# Altium schematic sheet IsolatedADC.SCHDOC
size A4; Organization: UNSW Solar Racing Team; Address3: UNSW; Address4: Sydney NSW 2052; Address2: Electrical Engineering; Address1: Rm 109
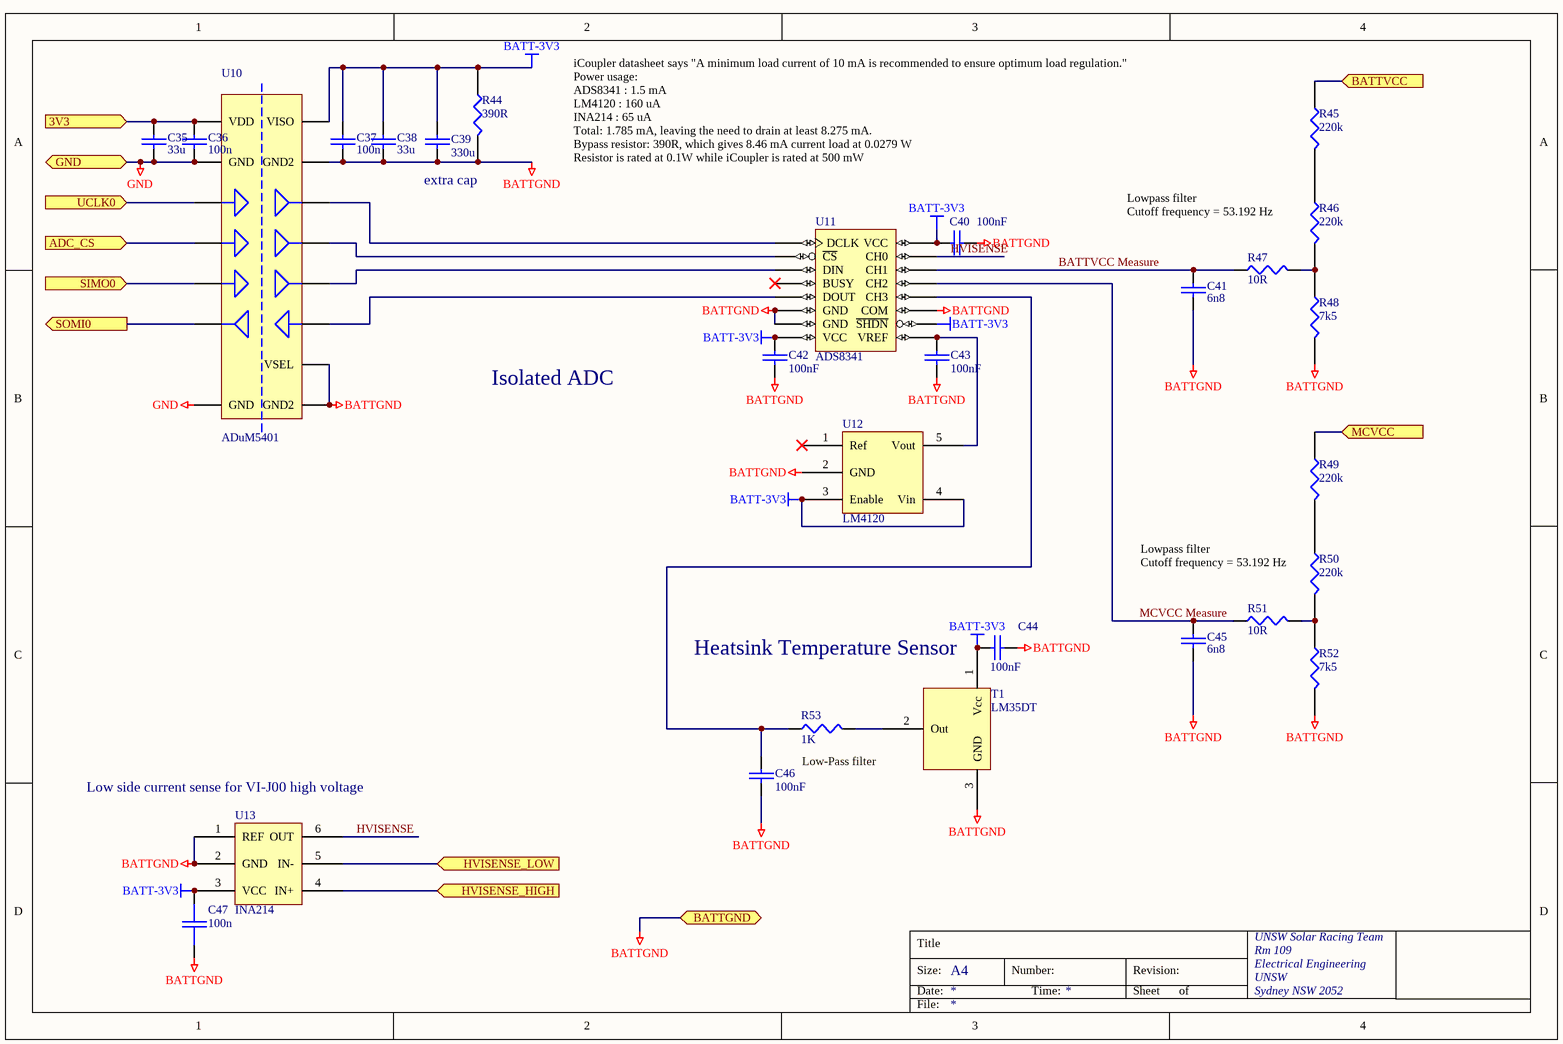
[diagram p0: IsolatedADC.SCHDOC]

## Parts
C35  33u  [MCCT-CASEB]
C36  100n  [0603]
C37  100n  [0603]
C38  33u  [MCCT-CASEB]
C39  330u  [KEMET_CASED]
C40  100nF  [0603]
C41  6n8  [0603]
C42  100nF  [0603]
C43  100nF  [0603]
C44  100nF  [0603]
C45  6n8  [0603]
C46  100nF  [0603]
C47  100n  [0603]
R44  390R  [0603]
R45  220k  [1206]
R46  220k  [1206]
R47  10R  [0603]
R48  7k5  [1206]
R49  220k  [1206]
R50  220k  [1206]
R51  10R  [0603]
R52  7k5  [1206]
R53  1K  [0603]
T1  LM35DT  [TO-220-up]
U10  ADuM5401  [SOIC_W16]
U11  ADS8341  [TSSOP16]
U12  LM4120  [SOT23-5]
U13  INA214  [SC70-6]

## Ports
3V3 (in), ADC_CS (in), BATTGND, BATTVCC (in), GND (bidir), HVISENSE_HIGH (in), HVISENSE_LOW (in), MCVCC (in), SIMO0 (in), SOMI0 (out), UCLK0 (in)

## Nets
BATT-3V3: C37.2 C38.2 C39.1 C40.1 C42.2 C44.1 C47.2 R44.1 T1.1(Vcc) U10.16(VISO) U11.1(VCC) U11.7(~{SHDN}) U11.9(VCC) U12.3(Enable) U12.4(Vin) U13.3(VCC)
BATTGND: C37.1 C38.1 C39.2 C40.2 C41.2 C42.1 C43.2 C44.2 C45.2 C46.2 C47.1 R44.2 R48.2 R52.2 T1.3(GND) U10.9(GND2) U10.10(VSEL) U10.15(GND2) U11.6(COM) U11.10(GND) U11.11(GND) U12.2(GND) U13.1(REF) U13.2(GND) ; port BATTGND
GND: C35.1 C36.1 U10.2(GND) U10.8(GND) ; port GND
3V3: C35.2 C36.2 U10.1(VDD) ; port 3V3
ADC_CS: U10.4(IN2) ; port ADC_CS
BATTVCC: R45.1 ; port BATTVCC
BATTVCC Measure: C41.1 R47.1 U11.3(CH1)
HVISENSE: U11.2(CH0) U13.6(OUT)
HVISENSE_HIGH: U13.4(IN+) ; port HVISENSE_HIGH
HVISENSE_LOW: U13.5(IN-) ; port HVISENSE_LOW
MCVCC: R49.1 ; port MCVCC
MCVCC Measure: C45.1 R51.1 U11.4(CH2)
SIMO0: U10.5(IN3) ; port SIMO0
SOMI0: U10.6(OUT4) ; port SOMI0
UCLK0: U10.3(IN1) ; port UCLK0
NetC43_1: C43.1 U11.8(VREF) U12.5(Vout)
NetC46_1: C46.1 R53.1 U11.5(CH3)
NetR45_2: R45.2 R46.1
NetR46_2: R46.2 R47.2 R48.1
NetR49_2: R49.2 R50.1
NetR50_2: R50.2 R51.2 R52.1
NetR53_2: R53.2 T1.2(Out)
NetU10_11: U10.11(IN4) U11.12(DOUT)
NetU10_12: U10.12(OUT3) U11.14(DIN)
NetU10_13: U10.13(OUT2) U11.15(~{CS})
NetU10_14: U10.14(OUT1) U11.16(DCLK)

Not connected (* = marked no-connect by the designer): U11 13(BUSY)*; U12 1(Ref)*

## Notes on the sheet
- extra cap
- iCoupler datasheet says "A minimum load current of 10 mA is recommended to ensure optimum load regulation."
  Power usage:
  ADS8341 : 1.5 mA
  LM4120 : 160 uA
  INA214 : 65 uA
  Total: 1.785 mA, leaving the need to drain at least 8.275 mA.
  Bypass resistor: 390R, which gives 8.46 mA current load at 0.0279 W
  Resistor is rated at 0.1W while iCoupler is rated at 500 mW
- (near R46) Lowpass filter
  Cutoff frequency = 53.192 Hz
- Isolated ADC
- (near R50) Lowpass filter
  Cutoff frequency = 53.192 Hz
- (near C44) Heatsink Temperature Sensor
- (near U13) Low side current sense for VI-J00 high voltage
- Low-Pass filter
- Title
- Size:
- Date:
- A4
- Number:
- Time:
- Revision:
- Sheet
- of
- File:

## Library data of the parts
C35-C43 C45-C47 = CAP: Capacitor
  C35 C38: Farnell: 1135177; FarnellPrice: 0.64
  C39: Farnell: 1183405; FarnellPrice: 2.60; Digikey: 399-3884-1-ND; DigikeyPrice: 2.1
  C40 C42 C43 C46: Farnell: 753-567; Price: 0.31
  C41 C45: Farnell: 1642280
  C47: Price: 0.30
C44 = CAP: Capacitor; Order#: 753-567; Price: 0.31; Supplier: Farnell
R44-R46 R48-R50 R52 = RES1
  R44: Digikey: P390GCT-ND
  R45 R46 R49 R50: Farnell: 308-9587; Price: 1.16; Digikey: -
  R48 R52: Farnell: 308-6150; Price: 1.16
R47 R51 R53 = RES1: Resistor
  R47 R51: Farnell: ?
T1 = LM35DZ: Temperature Sensor; Farnell: 1469235; FarnellPrice: 5.13
U10 = ADuM5401: Optocoupler w/ DCDC; Digikey: ADUM5401ARWZ-ND
U12 = LM4120: Precision LDO voltage reference; Farnell: 9778802; FarnellPrice: 5.10; Digikey: LM4120AIM5-3.0CT-ND; DigikeyPrice: 2.95
U13 = INA214: Current Sensor; Farnell: 1606447
U11 = ADS8341: Farnell: 1212292; FarnellPrice: 27.40; Digikey: ADS8341E-ND; DigikeyPrice: 12.33